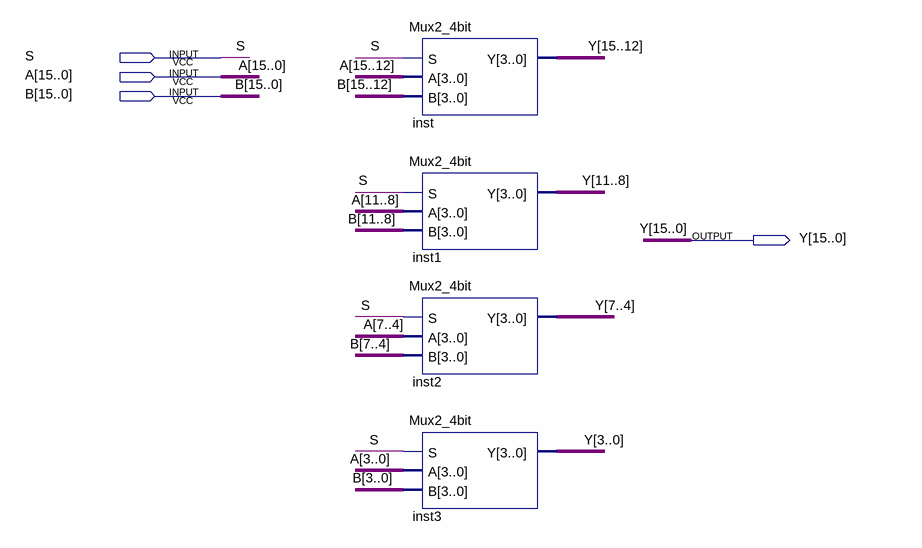
[diagram p0: schematic sheet]
// Quartus schematic Mux2_16bit.bdf as structural Verilog: 4 symbols, 4 pins
module Mux2_16bit (
  input  S,
  input  [15:0] A,
  input  [15:0] B,
  output [15:0] Y
);

  Mux2_4bit inst (.S(S), .A(A[15:12]), .B(B[15:12]), .Y(Y[15:12]));
  Mux2_4bit inst1 (.S(S), .A(A[11:8]), .B(B[11:8]), .Y(Y[11:8]));
  Mux2_4bit inst2 (.S(S), .A(A[7:4]), .B(B[7:4]), .Y(Y[7:4]));
  Mux2_4bit inst3 (.S(S), .A(A[3:0]), .B(B[3:0]), .Y(Y[3:0]));
endmodule
